# Altium schematic sheet Power.SchDoc
size A
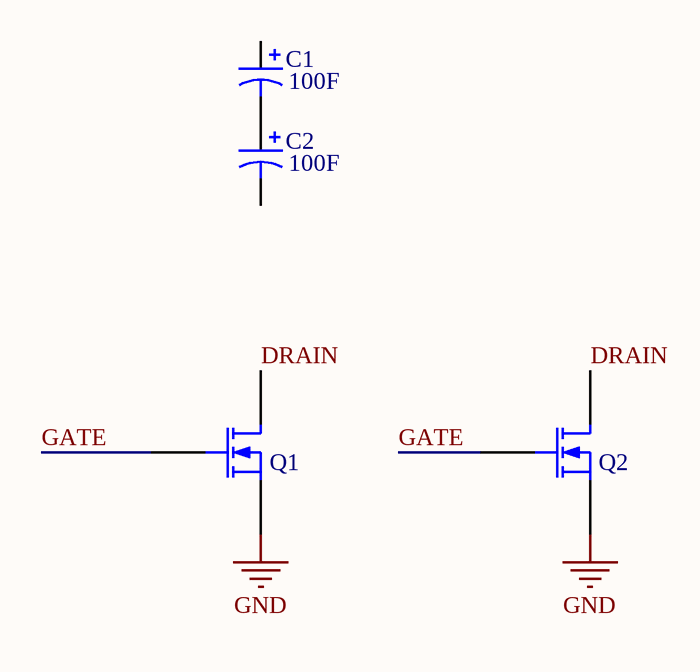
[diagram p0: Power.SchDoc]

## Parts
C1  value 100F  [CAP]
C2  value 100F  [CAP]
Q1  MOSFET-N  [TO220V]  (value not drawn)
Q2  MOSFET-N  [TO220V]  (value not drawn)

## Nets
GND: Q1.3(S) Q2.3(S)
DRAIN: Q1.2(D) Q2.2(D)
GATE: Q1.1(G) Q2.1(G)
NetC1_2: C1.2 C2.1

Not connected (* = marked no-connect by the designer): C1 1; C2 2

## Library data of the parts
C1 C2 = CAP: Polarized Capacitor (Axial); Published: 8-Jun-2000; LatestRevisionDate: 17-Jul-2002; LatestRevisionNote: Re-released for DXP Platform.; PackageReference: POLAR0.8; Publisher: Altium Limited; PackageDescription: Polarized Capacitor; 2 Leads
Q1 Q2 = MOSFET-N: N-Channel MOSFET; Published: 8-Jun-2000; LatestRevisionDate: 17-Jul-2002; LatestRevisionNote: Re-released for DXP Platform.; PackageVersion: 1995/1996; PackageReference: E3; Publisher: Altium Limited; PackageDescription: TO, Flat Index; 3 In-Line, Axial Leads; Body Dia. 4.6mm; Lead Dia. 0.5 mm (max)